# EAGLE design Triac x4 (EAGLE 6.4)
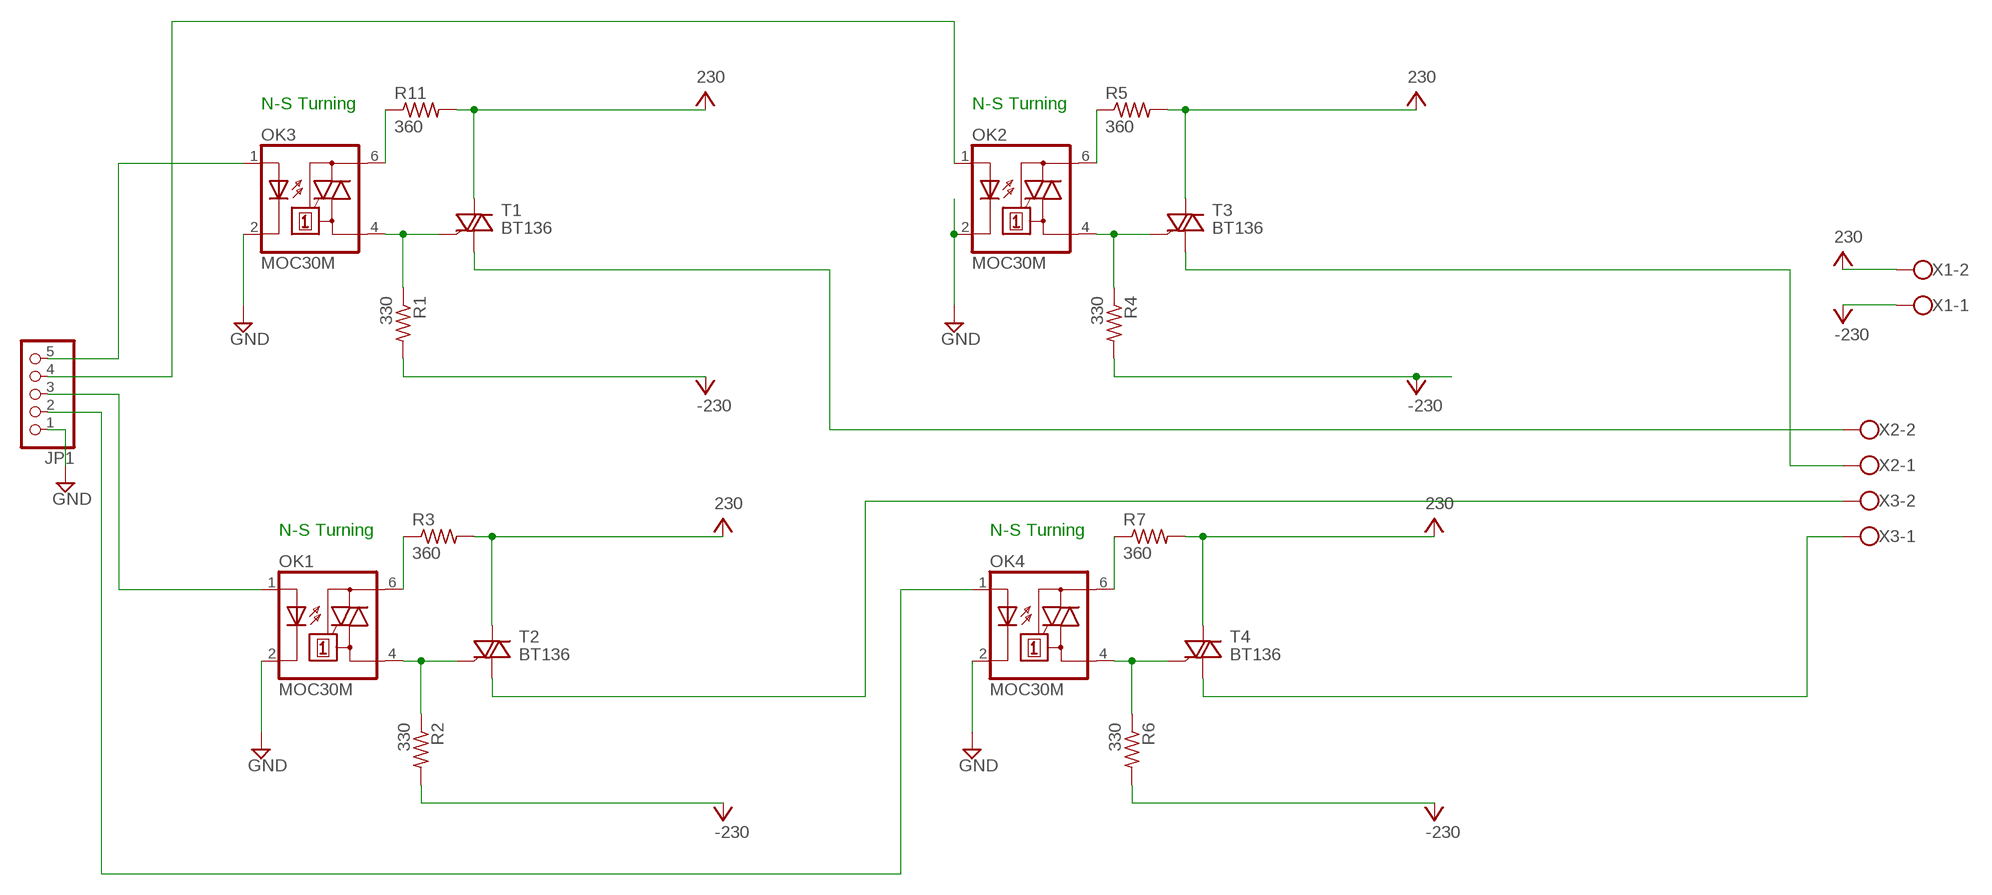
[diagram p0: schematic, sheet 1]

## Parts
JP1  PINHD-1X5  [1X05]
OK1  MOC30M  MOC3023M  [DIL06]
OK2  MOC30M  MOC3023M  [DIL06]
OK3  MOC30M  MOC3023M  [DIL06]
OK4  MOC30M  MOC3023M  [DIL06]
R1  330  R-US_0207/7  [0207/7]
R2  330  R-US_0207/7  [0207/7]
R3  360  R-US_0207/7  [0207/7]
R4  330  R-US_0207/7  [0207/7]
R5  360  R-US_0207/7  [0207/7]
R6  330  R-US_0207/7  [0207/7]
R7  360  R-US_0207/7  [0207/7]
R11  360  R-US_0207/7  [0207/7]
T1  BT136  [TO220AB]
T2  BT136  [TO220AB]
T3  BT136  [TO220AB]
T4  BT136  [TO220AB]
X1  W237-102  [W237-102]
X2  W237-102  [W237-102]
X3  W237-102  [W237-102]

## Nets
GND: JP1.1 OK1.2(C) OK2.2(C) OK3.2(C) OK4.2(C)
N$1: OK3.6(A2) R11.1
N$2: T1.1(A1) X2.2
N$3: JP1.5 OK3.1(A)
N$4: T2.1(A1) X3.2
N$5: OK1.4(A1) R2.1 T2.3(G)
N$6: OK1.6(A2) R3.1
N$7: JP1.4 OK2.1(A)
N$8: T3.1(A1) X2.1
N$9: OK2.4(A1) R4.1 T3.3(G)
N$10: OK2.6(A2) R5.1
N$11: JP1.3 OK1.1(A)
N$12: T4.1(A1) X3.1
N$13: OK4.4(A1) R6.1 T4.3(G)
N$14: OK4.6(A2) R7.1
N$15: JP1.2 OK4.1(A)
N$16: OK3.4(A1) R1.1 T1.3(G)
V+: R3.2 R5.2 R7.2 R11.2 T1.2(A2) T2.2(A2) T3.2(A2) T4.2(A2) X1.2 ; supply symbol labelled 230
V-: R1.2 R2.2 R4.2 R6.2 X1.1 ; supply symbol labelled -230

## Notes on the sheet
- N-S Turning | N-S Turning
- N-S Turning | N-S Turning

## Library data of the parts
JP1 = pinhead:PINHD-1X5: PIN HEADER
OK1-OK4 = optocoupler:MOC30*M: RANDOM-PHASE OPTOISOLATORS TRIAC DRIVER OUTPUT Source: http://www.fairchildsemi.com MOC3020-M.pdf; MF: FAIRCHILD SEMICONDUCTOR; MPN: MOC3023-M; OC_FARNELL: 1021367; OC_NEWARK: 72K8896
R1-R7 R11 = resistor:R-US_: RESISTOR, American symbol
T1-T4 = triac:BT136: Triac BT136 series E sensitive gate Source: http://www.nxp.com/acrobat_download/datasheets/BT136_SERIES_E_2.pdf
X1-X3 = con-wago-500:W237-102: WAGO SCREW CLAMP; MPN: 237-102; OC_FARNELL: unknown; OC_NEWARK: 70K9898

## Board
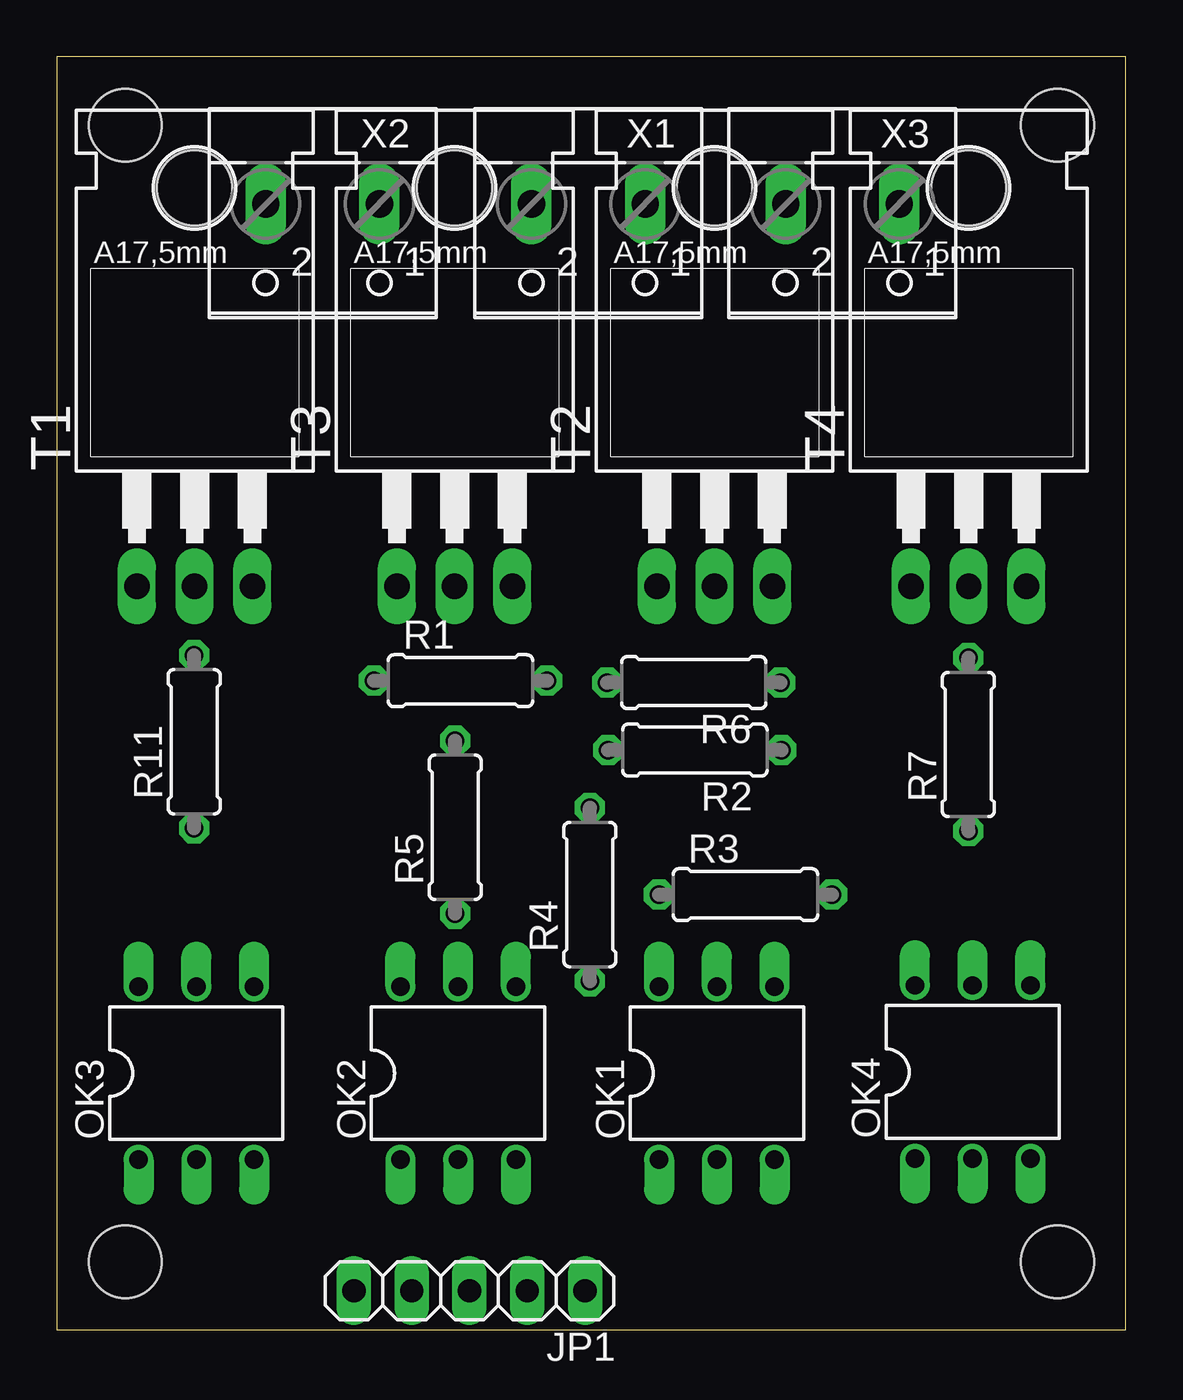
[diagram p1: board, top side]
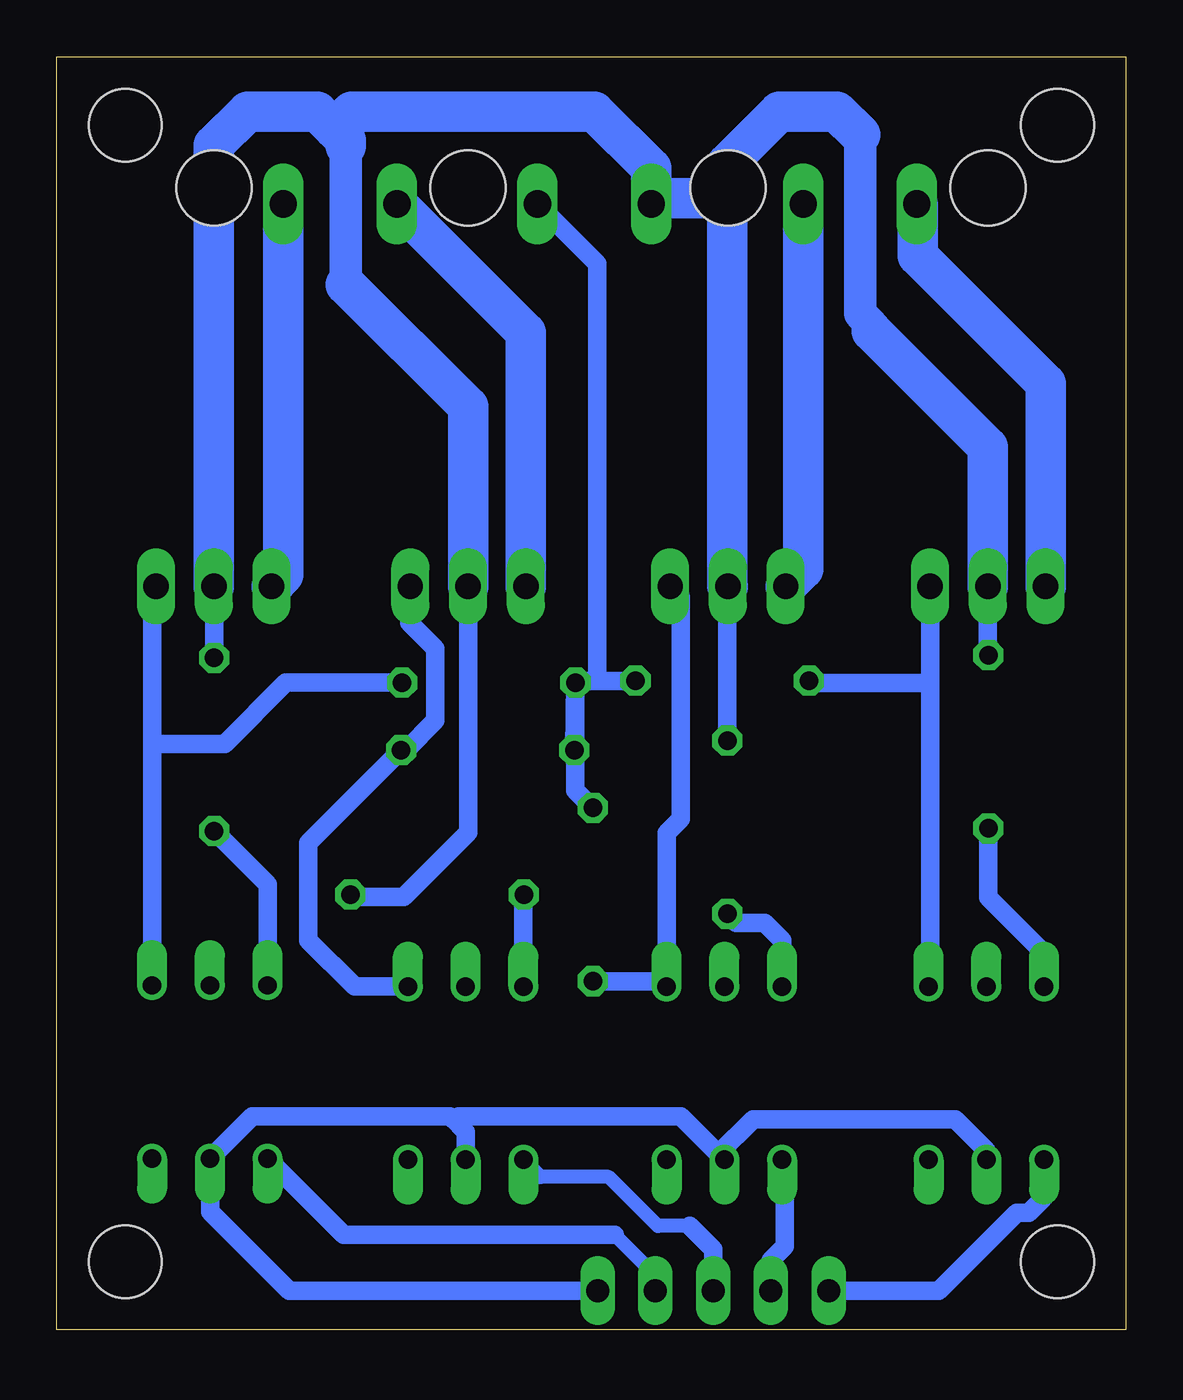
[diagram p2: board, bottom side, seen from below]

Size 47 x 56 mm. Coordinates in mm from the lower left corner, seen from the top.
Outline: 0,0 47,0 47,56 0,56 0,0
Copper layers (1*16): Top 0.035mm / dielectric 1.5mm / Bottom 0.035mm
Design rules "default": minimum track width 10mil, minimum drill 24mil, track to track 8mil, track to pad 8mil, pad to pad 8mil, via to via 8mil, smd to smd 8mil, copper to edge 40mil, drill to drill 8mil, minimum pad ring 10mil, minimum via ring 8mil, stop-mask expansion 4mil, vias tented up to drill 0mil, thermal gap 10mil
Holes 3.2 mm at 3,3 44,3 44,53 3,53

### Footprints (pad centres in the part's own frame; a part is rotated, then mirrored left to right if it is on the bottom)
1X05 = drill 1.016 long: 1 -5.08,0; 2 -2.54,0; 3 0,0; 4 2.54,0; 5 5.08,0
DIL06 = drill 0.813 offset: 1 -2.54,-3.81; 2 0,-3.81; 3 2.54,-3.81; 4 2.54,3.81; 5 0,3.81; 6 -2.54,3.81
0207/7 = drill 0.813 octagon: 1 -3.81,0; 2 3.81,0
TO220AB = drill 1.118 long: 1 -2.54,-6.35; 2 0,-6.35; 3 2.54,-6.35 | hole 3.302: 0,11.176
W237-102 = drill 1.194 long: 1 -2.5,-1.27; 2 2.5,-1.27

### Placement (x,y rotation side)
JP1  18.14,1.73 180 top
OK1  29.02,11.29 0 top
OK2  17.64,11.29 0 top
OK3  6.13,11.29 0 top
OK4  40.27,11.35 0 top
R1  17.75,28.56 0 top
R2  28.05,25.5 180 top
R3  30.28,19.15 0 top
R4  23.43,19.15 90 top
R5  17.51,22.11 90 top
R6  28,28.47 180 top
R7  40.08,25.75 90 top
R11  6.04,25.87 90 top
T1  6.06,39.06 0 top
T2  28.92,39.06 0 top
T3  17.49,39.06 0 top
T4  40.1,39.06 0 top
X1  23.37,48.26 180 top
X2  11.68,48.26 180 top
X3  34.54,48.26 180 top

### Tracks (layer width: path | path; a pad name or v marks a point on that pad's centre or on a via)
GND
  Bottom 0.813: JP1.1 36.78,1.73 40.26,5.21 40.26,7.52 OK4.2 38.41,9.4 29.72,9.4 29.34,9.02 | OK1.2 29.02,8.71 29.34,9.02 | 29.34,9.02 29.34,9.4 19.56,9.4 17.91,7.75 | 17.91,7.75 OK2.2 | 17.91,7.75 16.38,9.27 7.49,9.27 6.13,7.91 OK3.2
N$1
  Bottom 0.813: OK3.6 3.59,16.57 6.04,19.02 R11.1
N$2
  Bottom 1.778: T1.1 3.52,41.62 9.14,47.24 9.14,49.49 X2.2
N$3
  Bottom 0.813: OK3.1 3.56,7.45 3.63,7.37 3.63,5.79 4.27,5.16 4.8,5.16 8.23,1.73 JP1.5
N$4
  Bottom 1.778: T2.1 26.38,43.87 X3.2
N$5
  Bottom 0.813: OK1.4 33.9,15.11 35.94,17.14 35.94,21.43 R2.1 31.64,25.5 30.35,26.8 30.35,29.97 31.5,31.11 31.5,32.67 T2.3
N$6
  Bottom 0.813: R3.1 26.48,19.13 OK1.6
N$7
  Bottom 0.813: JP1.4 15.6,3.06 14.99,3.68 14.99,7.37 OK2.1
N$8
  Bottom 1.778: X2.1 14.18,33.47 T3.1
N$9
  Bottom 0.813: R4.1 20.42,15.34 OK2.4 20.18,21.85 19.56,22.48 19.56,32.23 T3.3
N$10
  Bottom 0.813: R5.1 17.12,17.91 15.88,17.91 15.11,17.14 OK2.6
N$11
  Bottom 0.61: 19.18,4.57 20.57,4.57 22.73,6.73 25.73,6.73 OK1.1
  Bottom 0.813: JP1.3 18.14,3.54 19.18,4.57
N$12
  Bottom 1.778: X3.1 37.04,33.22 T4.1
N$13
  Bottom 0.813: OK4.4 42.81,25.65 | 42.81,25.65 42.81,32.53 T4.3 | R6.1 36.93,28.47 39.62,25.78 42.69,25.78 42.81,25.65
N$14
  Bottom 0.813: OK4.6 37.73,19.6 R7.1
N$15
  Bottom 0.61: JP1.2 20.68,2.4 22.48,4.19
  Bottom 0.813: 22.48,4.19 34.39,4.19 OK4.1
N$16
  Bottom 0.813: OK3.4 8.6,15.18 8.6,28.45 | 8.6,28.45 T1.3 | R1.1 13.83,28.45 8.6,28.45
V+
  Bottom 0.813: R11.2 6.06,29.71 T1.2 | T3.2 17.51,32.68 R5.2 | T2.2 28.92,21.88 31.75,19.05 33.99,19.05 R3.2 | R7.2 40.08,32.69 T4.2
  Bottom 1.422: 11.18,43.94 11.18,44.2 11.68,44.7 11.68,52.58 | 34.29,45.97 34.29,52.07
  Bottom 1.778: T1.2 6.06,38.83 11.18,43.94 | 11.68,52.58 12.7,53.59 15.24,53.59 17.53,51.31 17.53,49.78 | 17.53,49.78 17.53,32.74 T3.2 | T2.2 28.92,40.6 34.29,45.97 | 34.29,52.07 34.29,52.32 34.8,52.83 | 34.8,52.83 35.56,53.59 38.61,53.59 40.1,52.11 T4.2 | 17.53,49.78 20.61,49.78 X1.2 20.87,51.09 23.37,53.59 34.04,53.59 34.8,52.83
V-
  Bottom 0.813: R1.2 23.26,28.55 | R6.2 24.24,25.6 R2.2 | R4.2 24.2,23.72 R6.2 | R6.2 24.11,28.55 23.26,28.55 | 23.26,28.55 23.24,28.57 23.24,46.9 X1.1